# EAGLE design R121X (EAGLE 6.6.0)
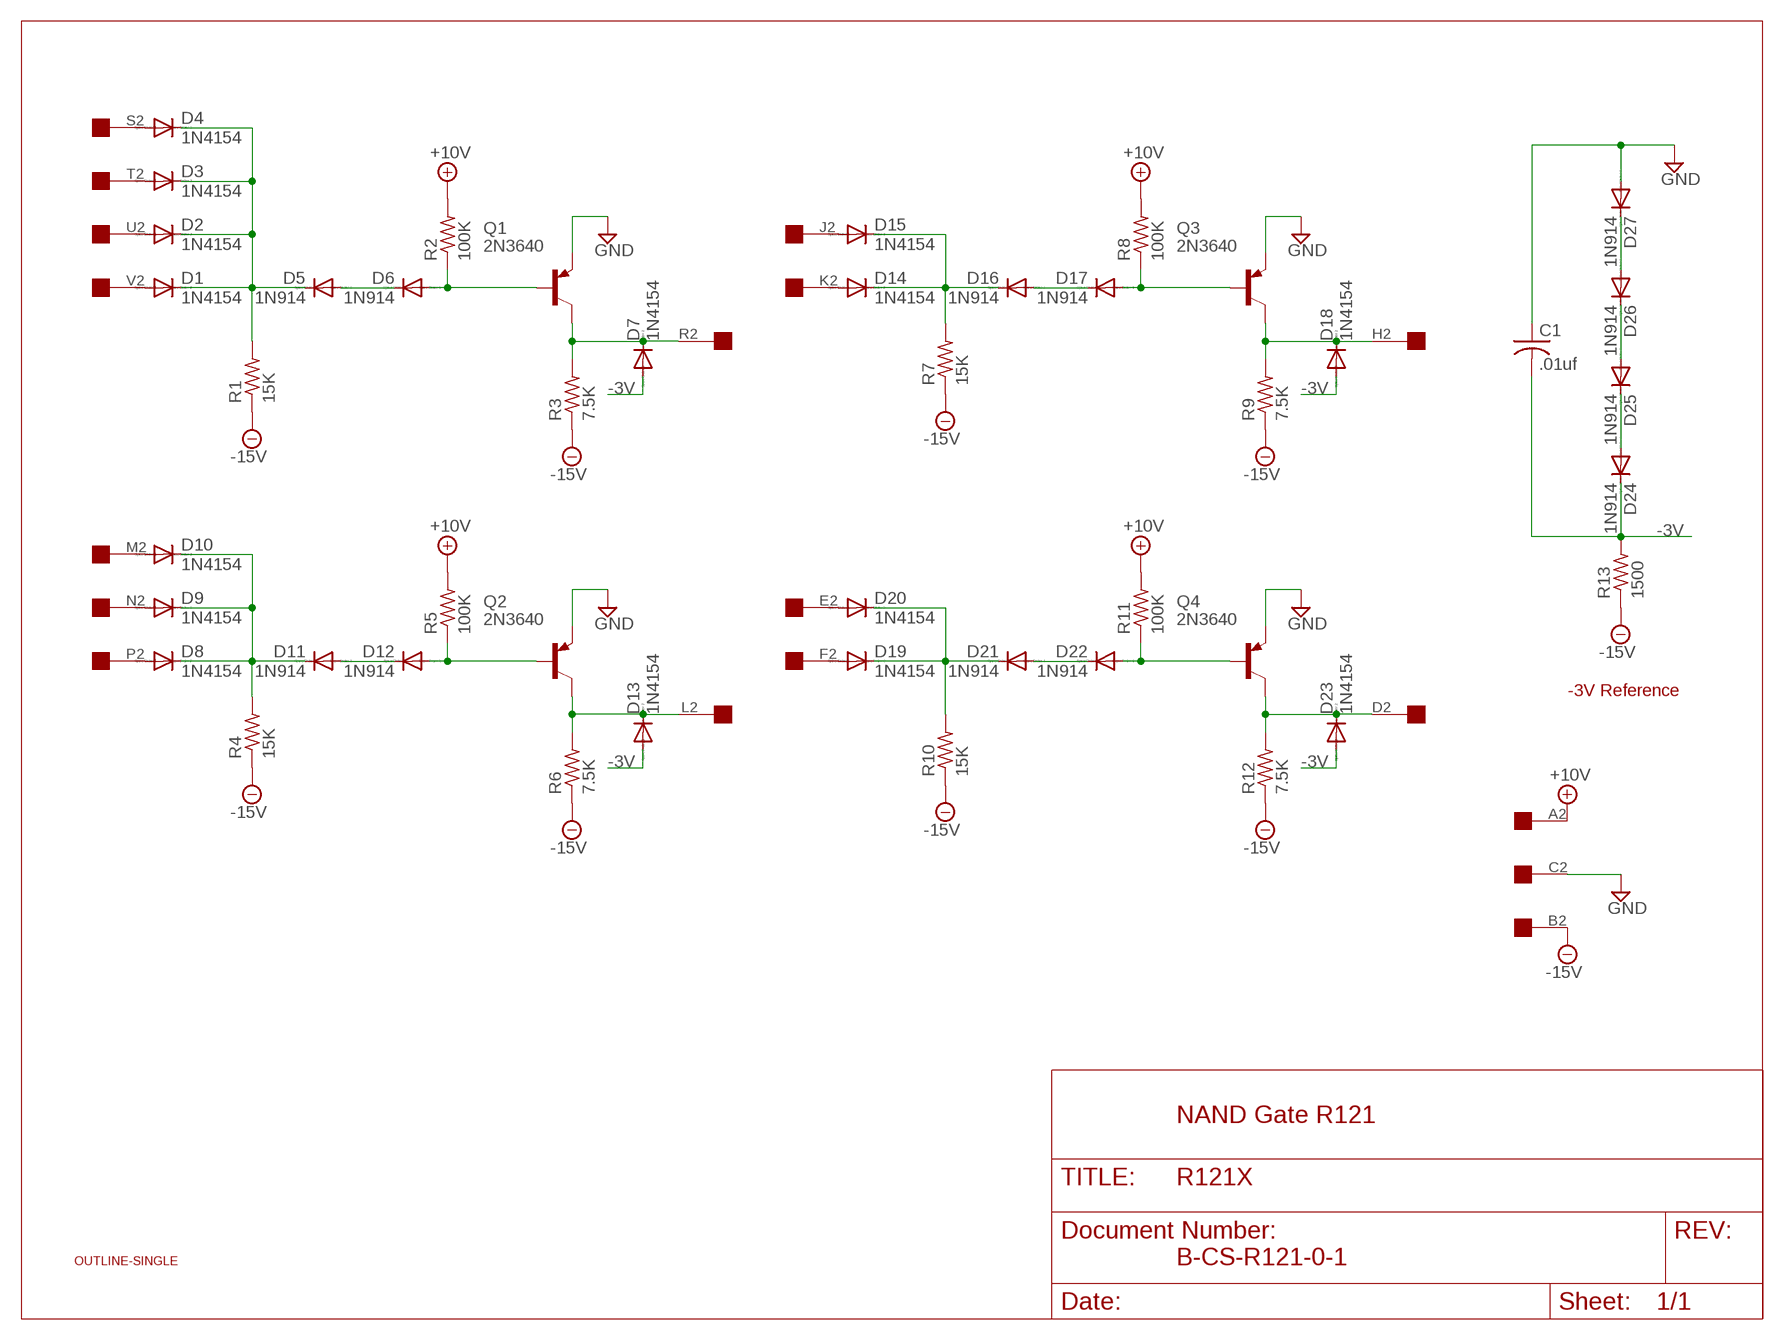
[diagram p0: schematic, sheet 1]

## Parts
C1  .01uf  C-US050-025X075  [C050-025X075]
D1  1N4154  1N4148DO35-10  [DO35-10]
D2  1N4154  1N4148DO35-10  [DO35-10]
D3  1N4154  1N4148DO35-10  [DO35-10]
D4  1N4154  1N4148DO35-10  [DO35-10]
D5  1N914  1N4148DO35-10  [DO35-10]
D6  1N914  1N4148DO35-10  [DO35-10]
D7  1N4154  1N4148DO35-10  [DO35-10]
D8  1N4154  1N4148DO35-10  [DO35-10]
D9  1N4154  1N4148DO35-10  [DO35-10]
D10  1N4154  1N4148DO35-10  [DO35-10]
D11  1N914  1N4148DO35-10  [DO35-10]
D12  1N914  1N4148DO35-10  [DO35-10]
D13  1N4154  1N4148DO35-10  [DO35-10]
D14  1N4154  1N4148DO35-10  [DO35-10]
D15  1N4154  1N4148DO35-10  [DO35-10]
D16  1N914  1N4148DO35-10  [DO35-10]
D17  1N914  1N4148DO35-10  [DO35-10]
D18  1N4154  1N4148DO35-10  [DO35-10]
D19  1N4154  1N4148DO35-10  [DO35-10]
D20  1N4154  1N4148DO35-10  [DO35-10]
D21  1N914  1N4148DO35-10  [DO35-10]
D22  1N914  1N4148DO35-10  [DO35-10]
D23  1N4154  1N4148DO35-10  [DO35-10]
D24  1N914  1N4148DO35-10  [DO35-10]
D25  1N914  1N4148DO35-10  [DO35-10]
D26  1N914  1N4148DO35-10  [DO35-10]
D27  1N914  1N4148DO35-10  [DO35-10]
Q1  2N3640  2N3637  [TO39]
Q2  2N3640  2N3637  [TO39]
Q3  2N3640  2N3637  [TO39]
Q4  2N3640  2N3637  [TO39]
R1  15K  R-US_0207/10  [0207/10]
R2  100K  R-US_0207/10  [0207/10]
R3  7.5K  R-US_0207/10  [0207/10]
R4  15K  R-US_0207/10  [0207/10]
R5  100K  R-US_0207/10  [0207/10]
R6  7.5K  R-US_0207/10  [0207/10]
R7  15K  R-US_0207/10  [0207/10]
R8  100K  R-US_0207/10  [0207/10]
R9  7.5K  R-US_0207/10  [0207/10]
R10  15K  R-US_0207/10  [0207/10]
R11  100K  R-US_0207/10  [0207/10]
R12  7.5K  R-US_0207/10  [0207/10]
R13  1500  R-US_0207/10  [0207/10]
U$1  OUTLINE-SINGLE  [SINGLE]
U$2  EDGE-1  [EDGE-CON1]

## Nets
+10V [Power]: R2.2 R5.2 R8.2 R11.2 U$2.A2
-3V [Power]: C1.2 D7.A D13.A D18.A D23.A D24.C R13.2
-15V [Power]: R1.1 R3.1 R4.1 R6.1 R7.1 R9.1 R10.1 R12.1 R13.1 U$2.B2
GND [Power]: C1.1 D27.A Q1.1(E) Q2.1(E) Q3.1(E) Q4.1(E) U$2.C2
N$1: D8.A U$2.P2
N$2: D12.A Q2.2(B) R5.1
N$3: D26.A D27.C
N$4: D13.C Q2.3(C) R6.2 U$2.L2
N$5: D7.C Q1.3(C) R3.2 U$2.R2
N$6: D8.C D9.C D10.C D11.C R4.2
N$7: D11.A D12.C
N$8: D17.A Q3.2(B) R8.1
N$9: D18.C Q3.3(C) R9.2 U$2.H2
N$10: D14.A U$2.K2
N$11: D14.C D15.C D16.C R7.2
N$12: D16.A D17.C
N$13: D25.A D26.C
N$14: D9.A U$2.N2
N$15: D20.A U$2.E2
N$16: D24.A D25.C
N$17: D19.A U$2.F2
N$18: D22.A Q4.2(B) R11.1
N$19: D6.A Q1.2(B) R2.1
N$20: D4.A U$2.S2
N$21: D1.A U$2.V2
N$22: D1.C D2.C D3.C D4.C D5.C R1.2
N$23: D5.A D6.C
N$24: D23.C Q4.3(C) R12.2 U$2.D2
N$25: D3.A U$2.T2
N$26: D19.C D20.C D21.C R10.2
N$27: D21.A D22.C
N$28: D10.A U$2.M2
N$31: D15.A U$2.J2
N$39: D2.A U$2.U2

## Notes on the sheet
- -3V Reference
- NAND Gate R121
- B-CS-R121-0-1

## Library data of the parts
C1 = rcl:C-US: CAPACITOR, American symbol
D1-D27 = diode:1N4148: DIODE high speed (Philips)
Q1-Q4 = transistor-pnp:2N3637*: PNP Transistror
R1-R13 = rcl:R-US_: RESISTOR, American symbol
U$1 = dec-con:OUTLINE-*: Board outlines for DEC boards.
U$2 = dec-con:EDGE-1: Single-Sided DEC Edge Connector -- (side 2)

## Net classes
1 Power: width 0.813 mm

## Board
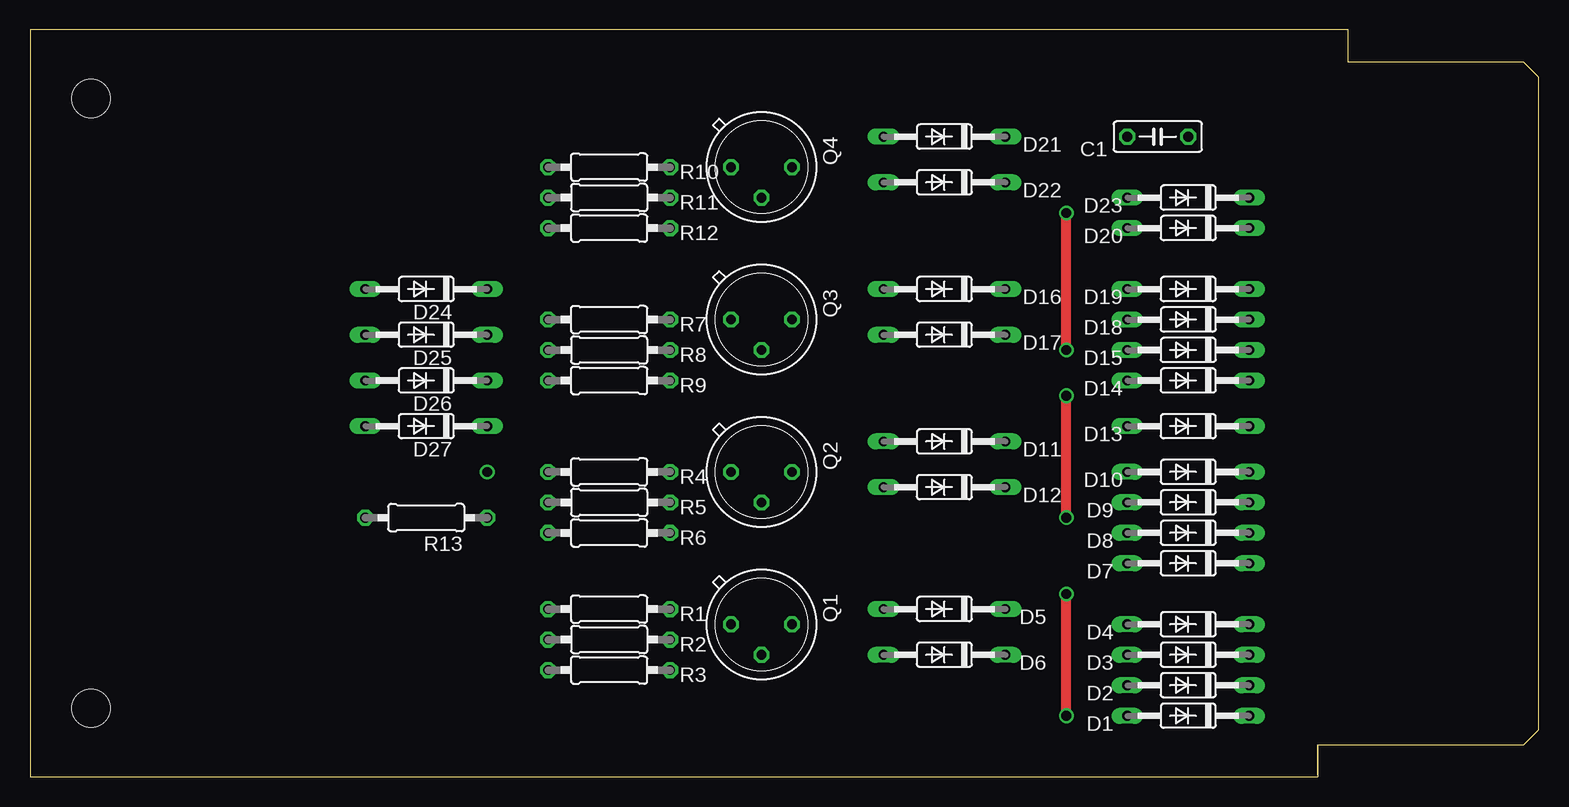
[diagram p1: board, top side]
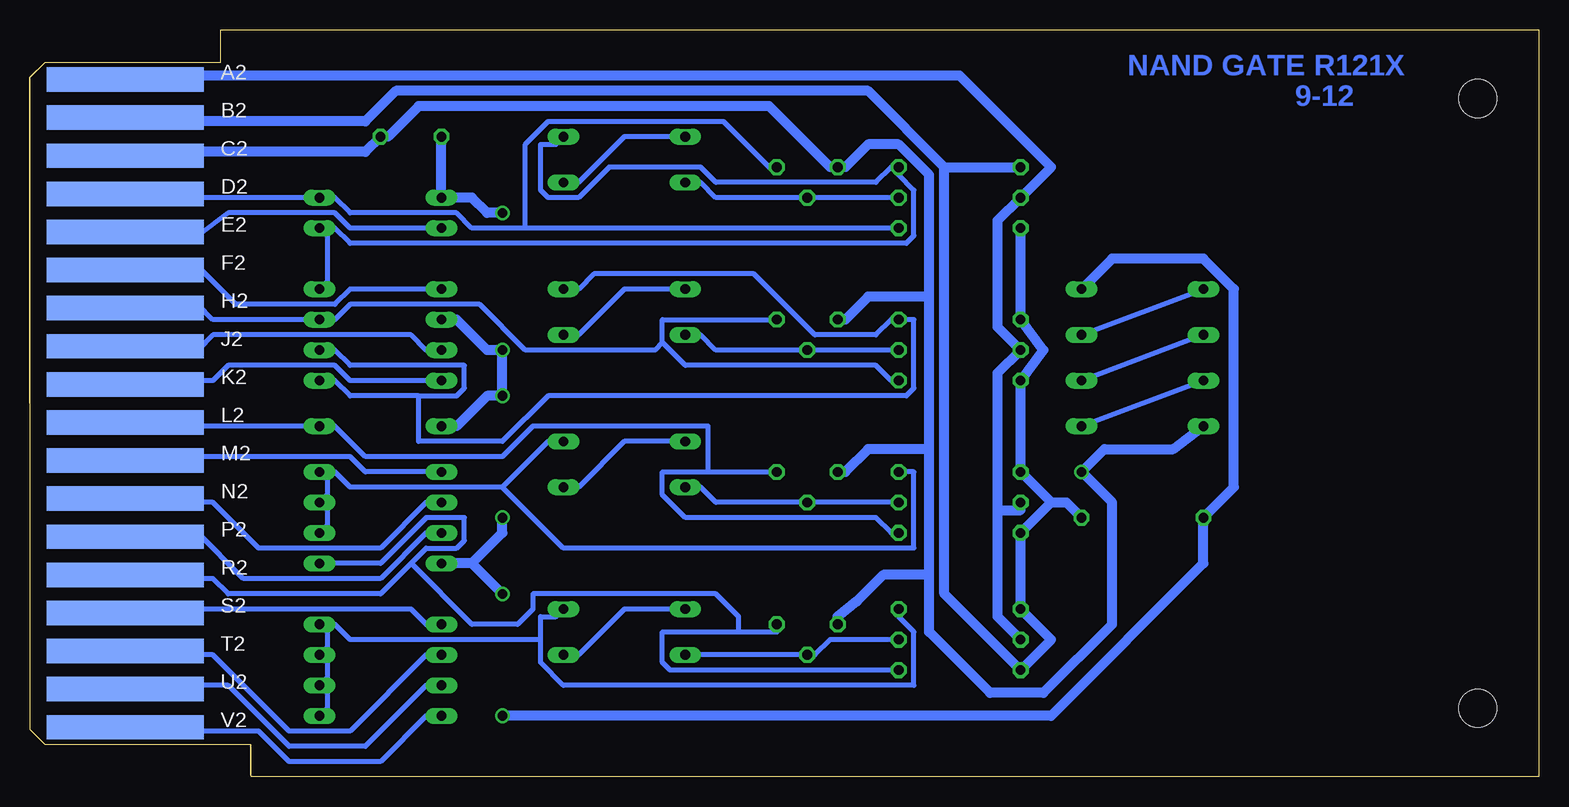
[diagram p2: board, bottom side, seen from below]

Size 125.73 x 62.23 mm. Coordinates in mm from the lower left corner, seen from the top.
Copper layers (1+16): Top 0.035mm / dielectric 1.5mm / Bottom 0.035mm
Design rules "16mils": minimum track width 16mil, minimum drill 32mil, track to track 15mil, track to pad 10mil, pad to pad 10mil, via to via 10mil, smd to smd 10mil, copper to edge 13mil, drill to drill 10mil, minimum pad ring 10mil, minimum via ring 8mil, stop-mask expansion 0mil, vias tented up to drill 0mil, thermal gap 10mil

### Footprints (pad centres in the part's own frame; a part is rotated, then mirrored left to right if it is on the bottom)
C050-025X075 = drill 0.813 octagon: 1 -2.54,0; 2 2.54,0
DO35-10 = drill 0.813 long: A 5.08,0; C -5.08,0
TO39 = drill 0.813 octagon: 1 0,-2.54; 2 2.54,0; 3 0,2.54
0207/10 = drill 0.813 octagon: 1 -5.08,0; 2 5.08,0
SINGLE = hole 3.175: 120.65,56.515; 120.65,5.715
EDGE-CON1 = smd 13.106 x 2.032 bottom: A2 7.938,4.128; B2 7.938,7.303; C2 7.938,10.477; D2 7.938,13.652; E2 7.938,16.828; F2 7.938,20.003; H2 7.938,23.177; J2 7.938,26.352; K2 7.938,29.527; L2 7.938,32.703; M2 7.938,35.877; N2 7.938,39.053; P2 7.938,42.227; R2 7.938,45.403; S2 7.938,48.578; T2 7.938,51.752; U2 7.938,54.928; V2 7.938,58.102

### Placement (x,y rotation side)
C1  93.98,53.34 180 top
D1  96.52,5.08 180 top
D2  96.52,7.62 180 top
D3  96.52,10.16 180 top
D4  96.52,12.7 180 top
D5  76.2,13.97 180 top
D6  76.2,10.16 180 top
D7  96.52,17.78 180 top
D8  96.52,20.32 180 top
D9  96.52,22.86 180 top
D10  96.52,25.4 180 top
D11  76.2,27.94 180 top
D12  76.2,24.13 180 top
D13  96.52,29.21 180 top
D14  96.52,33.02 180 top
D15  96.52,35.56 180 top
D16  76.2,40.64 180 top
D17  76.2,36.83 180 top
D18  96.52,38.1 180 top
D19  96.52,40.64 180 top
D20  96.52,45.72 180 top
D21  76.2,53.34 180 top
D22  76.2,49.53 180 top
D23  96.52,48.26 180 top
D24  33.02,40.64 180 top
D25  33.02,36.83 180 top
D26  33.02,33.02 180 top
D27  33.02,29.21 180 top
Q1  60.96,12.7 270 top
Q2  60.96,25.4 270 top
Q3  60.96,38.1 270 top
Q4  60.96,50.8 270 top
R1  48.26,13.97 0 top
R2  48.26,11.43 180 top
R3  48.26,8.89 0 top
R4  48.26,25.4 0 top
R5  48.26,22.86 180 top
R6  48.26,20.32 0 top
R7  48.26,38.1 0 top
R8  48.26,35.56 180 top
R9  48.26,33.02 0 top
R10  48.26,50.8 0 top
R11  48.26,48.26 180 top
R12  48.26,45.72 0 top
R13  33.02,21.59 180 top
U$1  125.73,62.23 180 top
U$2  125.73,62.23 180 top

### Tracks (layer width: path | path; a pad name or v marks a point on that pad's centre or on a via)
+10V
  Bottom 0.813: R2.2 45.09,13.34 45.09,22.23 | 45.09,22.23 43.18,22.23 R5.2 | 45.09,22.23 45.09,33.66 R8.2 45.09,37.47 45.09,46.35 R11.2 40.64,50.8 48.26,58.42 111.76,58.42 U$2.A2
-3V  (via drill 0.81)
  Top 0.813: v86.36,5.08 v86.36,15.24 | v86.36,21.59 v86.36,31.75 | v86.36,35.56 v86.36,46.99
  Bottom 0.813: D24.C 35.56,43.18 27.94,43.18 25.4,40.64 25.4,24.13 R13.2 27.94,17.78 40.64,5.08 v86.36,5.08 | C1.2 D23.A 88.9,48.26 87.63,46.99 v86.36,46.99 | D18.A 90.17,38.1 87.63,35.56 v86.36,35.56 v86.36,31.75 87.63,31.75 90.17,29.21 D13.A | v86.36,15.24 88.9,17.78 | 88.9,17.78 86.36,20.32 v86.36,21.59 | 88.9,17.78 D7.A
-15V
  Bottom 0.813: R12.1 R7.1 41.27,35.56 R9.1 R4.1 40.64,22.86 | 40.64,22.86 R6.1 R1.1 40.64,11.43 R3.1 49.53,15.24 49.53,50.8 | 40.64,22.86 39.37,22.86 R13.1 | 49.53,50.8 R10.1 | 49.53,50.8 55.88,57.15 95.25,57.15 97.79,54.61 111.76,54.61 U$2.B2
GND  (via drill 0.81)
  Bottom 0.813: U$2.C2 113.67,52.07 97.79,52.07 C1.1 95.89,53.34 93.34,55.88 64.14,55.88 59.05,50.8 Q4.1 57.78,50.8 55.88,52.7 53.34,52.7 50.8,50.16 50.8,40.01 | D27.A 30.48,27.3 36.2,27.3 v38.1,25.4 35.56,22.86 35.56,12.7 41.27,6.99 45.72,6.99 50.8,12.06 50.8,16.83 | 50.8,16.83 54.61,16.83 56.83,14.61 58.42,13.34 Q1.1 | 50.8,16.83 50.8,27.3 | 50.8,27.3 55.88,27.3 57.78,25.4 Q2.1 | 50.8,40.01 55.88,40.01 57.78,38.1 Q3.1 | 50.8,27.3 50.8,40.01
N$1
  Bottom 0.406: D8.A 92.71,20.32 96.52,16.51 107.95,16.51 111.76,20.32 112.39,20.32 U$2.P2
N$2
  Bottom 0.406: R5.1 Q2.2 68.58,22.86 69.85,24.13 D12.A
N$3
  Bottom 0.406: D26.A D27.C
N$4
  Bottom 0.406: R6.2 53.98,20.32 55.24,21.59 71.12,21.59 73.03,23.5 73.03,25.4 69.22,25.4 | 69.22,25.4 Q2.3 | U$2.L2 111.76,29.21 D13.C 100.33,29.21 97.79,26.67 86.36,26.67 83.82,29.21 69.22,29.21 69.22,25.4
N$5
  Bottom 0.406: 66.67,12.06 63.5,12.06 Q1.3 | 66.67,12.06 73.03,12.06 73.03,9.53 72.39,8.89 R3.2 | 66.67,12.06 66.67,13.34 68.58,15.24 83.82,15.24 83.82,13.97 85.09,12.7 88.9,12.7 93.98,17.78 | D7.C 96.52,17.78 92.71,21.59 89.53,21.59 89.53,19.68 90.17,19.05 92.71,19.05 93.98,17.78 | 93.98,17.78 96.52,15.24 109.22,15.24 110.49,16.51 111.76,16.51 U$2.R2
N$6
  Bottom 0.406: D8.C 100.97,20.95 100.97,22.23 D9.C 100.97,23.5 100.97,24.77 D10.C 100.33,25.4 99.06,24.13 86.36,24.13 | 86.36,24.13 82.55,27.94 D11.C | R4.2 52.07,25.4 52.07,19.05 81.28,19.05 86.36,24.13
N$7
  Bottom 0.406: D12.C 80.01,24.13 76.2,27.94 D11.A
N$8
  Bottom 0.406: R8.1 Q3.2 68.58,35.56 69.85,36.83 D17.A
N$9
  Bottom 0.406: 73.03,36.2 71.12,34.29 55.24,34.29 53.98,33.02 R9.2 | 73.03,36.2 73.03,38.1 Q3.3 | U$2.H2 111.76,39.37 110.49,38.1 D18.C 100.33,38.1 99.06,39.37 88.27,39.37 84.45,35.56 73.66,35.56 73.03,36.2
N$10
  Bottom 0.406: D14.A 99.06,33.02 100.33,34.29 109.22,34.29 110.49,33.02 111.76,33.02 U$2.K2
N$11
  Bottom 0.406: 93.34,31.75 90.17,31.75 89.53,32.38 89.53,34.29 99.06,34.29 100.33,35.56 D15.C | 93.34,31.75 99.06,31.75 100.33,33.02 D14.C | D16.C 80.01,40.64 78.74,41.91 65.41,41.91 60.33,36.83 55.24,36.83 53.98,38.1 R7.2 52.07,38.1 52.07,32.38 52.7,31.75 82.55,31.75 86.36,27.94 93.34,27.94 93.34,31.75
N$12
  Bottom 0.406: D17.C 80.01,36.83 76.2,40.64 D16.A
N$13
  Bottom 0.406: D25.A D26.C
N$14
  Bottom 0.406: D9.A 92.71,22.86 96.52,19.05 106.68,19.05 110.49,22.86 111.76,22.86 U$2.N2
N$15
  Bottom 0.406: D20.A 99.06,45.72 100.33,46.99 109.22,46.99 111.76,45.09 U$2.E2
N$16
  Bottom 0.406: D25.C D24.A
N$17
  Bottom 0.406: D19.A 99.06,40.64 100.33,39.37 108.58,39.37 111.76,42.55 U$2.F2
N$18
  Bottom 0.406: R11.1 Q4.2 68.58,48.26 69.85,49.53 D22.A
N$19
  Bottom 0.406: R2.1 59.05,11.43 60.33,10.16 Q1.2 D6.A
N$20
  Bottom 0.406: D4.A 92.71,12.7 93.98,13.97 111.76,13.97 U$2.S2
N$21
  Bottom 0.406: D1.A 92.71,5.08 96.52,1.27 104.14,1.27 106.68,3.81 111.76,3.81 U$2.V2
N$22
  Bottom 0.406: D1.C 100.97,5.71 100.97,6.99 D2.C 100.97,8.26 100.97,9.53 D3.C 100.97,10.79 100.97,12.06 D4.C 100.33,12.7 99.06,11.43 83.19,11.43 | 83.19,11.43 83.19,13.34 81.92,13.34 D5.C | 83.19,11.43 83.19,9.53 81.28,7.62 52.07,7.62 52.07,12.06 53.34,13.34 R1.2
N$23
  Bottom 0.406: D6.C 80.01,10.16 76.2,13.97 D5.A
N$24
  Bottom 0.406: 84.45,45.72 88.9,45.72 90.17,46.99 99.06,46.99 100.33,48.26 D23.C 111.76,48.26 U$2.D2 | R12.2 84.45,45.72 | 84.45,45.72 84.45,52.7 82.55,54.61 67.94,54.61 64.14,50.8 Q4.3
N$25
  Bottom 0.406: D3.A 92.71,10.16 99.06,3.81 104.14,3.81 110.49,10.16 112.39,10.16 U$2.T2
N$26
  Bottom 0.406: D19.C 100.97,41.27 100.97,45.09 D20.C 100.33,45.72 99.06,44.45 52.7,44.45 52.07,45.09 52.07,48.9 53.34,50.16 R10.2 53.98,50.8 55.24,49.53 68.58,49.53 69.85,50.8 77.47,50.8 80.01,48.26 82.55,48.26 83.19,48.9 83.19,52.7 81.92,52.7 D21.C
N$27
  Bottom 0.406: D22.C 80.01,49.53 76.2,53.34 D21.A
N$28
  Bottom 0.406: D10.A 97.79,25.4 99.06,26.67 111.76,26.67 U$2.M2
N$31
  Bottom 0.406: D15.A 92.71,35.56 93.98,36.83 110.49,36.83 111.76,35.56 U$2.J2
N$39
  Bottom 0.406: D2.A 92.71,7.62 97.79,2.54 104.14,2.54 109.22,7.62 113.03,7.62 U$2.U2

### Text on the board
Bottom: NAND GATE R121X | 9-12